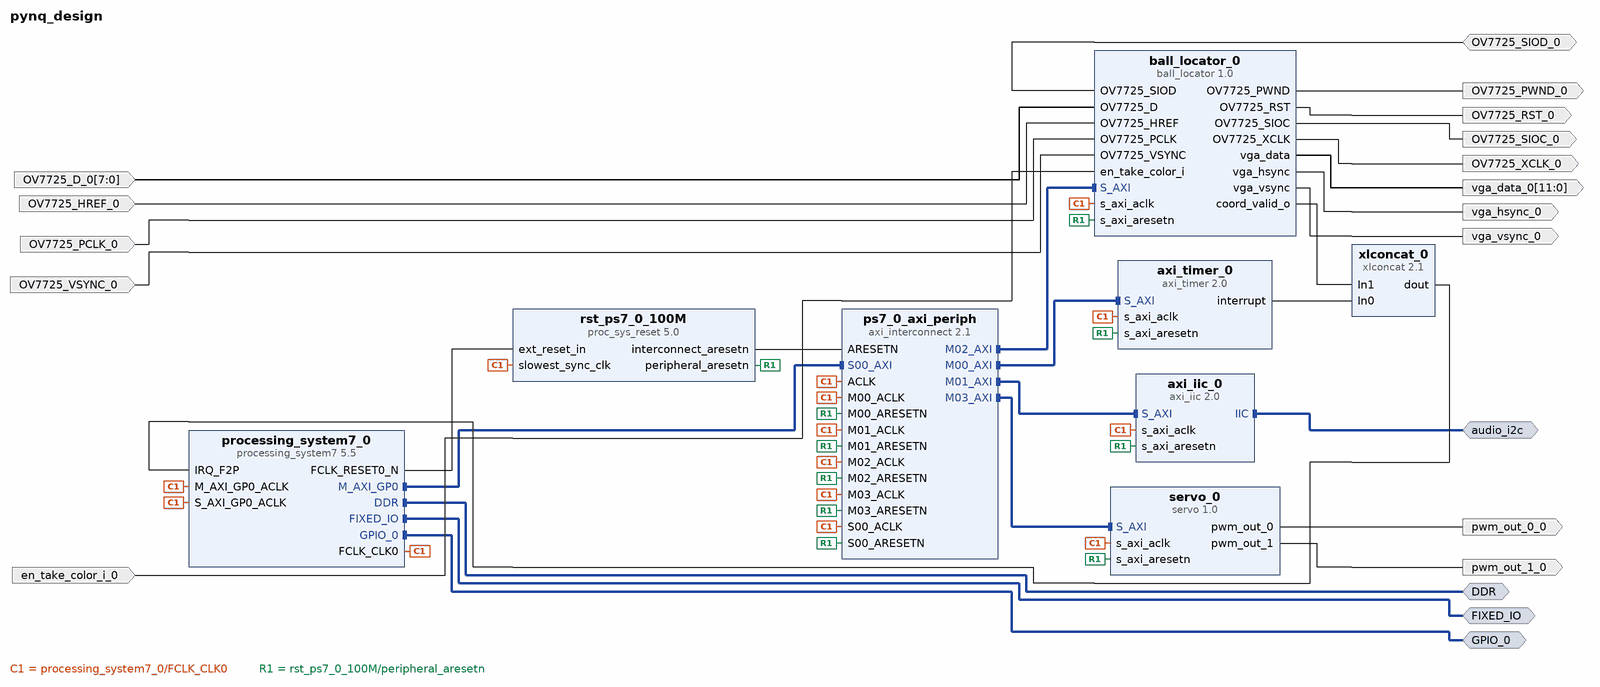
[diagram p0: block diagram of the top level]
# Vivado block design pynq_design, xc7z020clg400-1, Vivado 2018.2
create_bd_design pynq_design

create_bd_intf_port -mode Master -vlnv xilinx.com:interface:ddrx_rtl:1.0 DDR
create_bd_intf_port -mode Master -vlnv xilinx.com:display_processing_system7:fixedio_rtl:1.0 FIXED_IO
create_bd_intf_port -mode Master -vlnv xilinx.com:interface:gpio_rtl:1.0 GPIO_0
create_bd_intf_port -mode Master -vlnv xilinx.com:interface:iic_rtl:1.0 audio_i2c
create_bd_port -dir I -from 7 -to 0 OV7725_D_0
create_bd_port -dir I OV7725_HREF_0
create_bd_port -dir I OV7725_PCLK_0
create_bd_port -dir O OV7725_PWND_0
create_bd_port -dir O -type rst OV7725_RST_0
create_bd_port -dir O OV7725_SIOC_0
create_bd_port -dir IO OV7725_SIOD_0
create_bd_port -dir I OV7725_VSYNC_0
create_bd_port -dir O OV7725_XCLK_0
create_bd_port -dir I en_take_color_i_0
create_bd_port -dir O -from 11 -to 0 vga_data_0
create_bd_port -dir O vga_hsync_0
create_bd_port -dir O vga_vsync_0
create_bd_port -dir O pwm_out_0_0
create_bd_port -dir O pwm_out_1_0

create_bd_cell -type ip -vlnv xilinx.com:ip:processing_system7:5.5 processing_system7_0
set_property -dict [list \
  CONFIG.PCW_UIPARAM_DDR_FREQ_MHZ 525 \
  CONFIG.PCW_CRYSTAL_PERIPHERAL_FREQMHZ 50 \
  CONFIG.PCW_APU_PERIPHERAL_FREQMHZ 650 \
  CONFIG.PCW_UART_PERIPHERAL_FREQMHZ 100 \
  CONFIG.PCW_FPGA0_PERIPHERAL_FREQMHZ 100 \
  CONFIG.PCW_FPGA1_PERIPHERAL_FREQMHZ 142 \
  CONFIG.PCW_FPGA2_PERIPHERAL_FREQMHZ 200 \
  CONFIG.PCW_FPGA3_PERIPHERAL_FREQMHZ 160 \
  CONFIG.PCW_USE_S_AXI_GP0 1 \
  CONFIG.PCW_USE_FABRIC_INTERRUPT 1 \
  CONFIG.PCW_USE_HIGH_OCM 1 \
  CONFIG.PCW_GPIO_EMIO_GPIO_WIDTH 8 \
  CONFIG.PCW_IRQ_F2P_INTR 1 \
  CONFIG.PCW_GP0_EN_MODIFIABLE_TXN 0 \
  CONFIG.PCW_GP1_EN_MODIFIABLE_TXN 0 \
  CONFIG.PCW_PERIPHERAL_BOARD_PRESET part0 \
  CONFIG.PCW_PRESET_BANK1_VOLTAGE {LVCMOS 1.8V} \
  CONFIG.PCW_UIPARAM_DDR_BUS_WIDTH {16 Bit} \
  CONFIG.PCW_UIPARAM_DDR_PARTNO Custom \
  CONFIG.PCW_QSPI_PERIPHERAL_ENABLE 1 \
  CONFIG.PCW_QSPI_QSPI_IO {MIO 1 .. 6} \
  CONFIG.PCW_QSPI_GRP_SINGLE_SS_ENABLE 1 \
  CONFIG.PCW_QSPI_GRP_SINGLE_SS_IO {MIO 1 .. 6} \
  CONFIG.PCW_SINGLE_QSPI_DATA_MODE x4 \
  CONFIG.PCW_QSPI_GRP_FBCLK_ENABLE 1 \
  CONFIG.PCW_QSPI_GRP_FBCLK_IO {MIO 8} \
  CONFIG.PCW_ENET0_PERIPHERAL_ENABLE 1 \
  CONFIG.PCW_ENET0_ENET0_IO {MIO 16 .. 27} \
  CONFIG.PCW_ENET0_GRP_MDIO_ENABLE 1 \
  CONFIG.PCW_ENET0_GRP_MDIO_IO {MIO 52 .. 53} \
  CONFIG.PCW_ENET_RESET_ENABLE 0 \
  CONFIG.PCW_SD0_PERIPHERAL_ENABLE 0 \
  CONFIG.PCW_UART0_PERIPHERAL_ENABLE 1 \
  CONFIG.PCW_UART0_UART0_IO {MIO 14 .. 15} \
  CONFIG.PCW_UART1_PERIPHERAL_ENABLE 0 \
  CONFIG.PCW_WDT_PERIPHERAL_ENABLE 1 \
  CONFIG.PCW_WDT_WDT_IO EMIO \
  CONFIG.PCW_TTC0_PERIPHERAL_ENABLE 1 \
  CONFIG.PCW_TTC0_TTC0_IO EMIO \
  CONFIG.PCW_USB0_PERIPHERAL_ENABLE 0 \
  CONFIG.PCW_USB_RESET_ENABLE 0 \
  CONFIG.PCW_I2C_RESET_ENABLE 0 \
  CONFIG.PCW_GPIO_MIO_GPIO_ENABLE 1 \
  CONFIG.PCW_GPIO_MIO_GPIO_IO MIO \
  CONFIG.PCW_GPIO_EMIO_GPIO_ENABLE 1 \
  CONFIG.PCW_GPIO_EMIO_GPIO_IO 8 \
] [get_bd_cells processing_system7_0]
# 512 more settings of processing_system7_0 are not shown: defaults, MIO pin electricals, DDR timing, and values the tool derives
create_bd_cell -type ip -vlnv xilinx.com:ip:axi_timer:2.0 axi_timer_0
create_bd_cell -type ip -vlnv xilinx.com:ip:axi_interconnect:2.1 ps7_0_axi_periph
set_property -dict {CONFIG.NUM_MI 4} [get_bd_cells ps7_0_axi_periph]
create_bd_cell -type ip -vlnv xilinx.com:ip:proc_sys_reset:5.0 rst_ps7_0_100M
create_bd_cell -type ip -vlnv xilinx.com:ip:xlconcat:2.1 xlconcat_0
create_bd_cell -type ip -vlnv starrynightzyq.com:user:ball_locator:1.0 ball_locator_0
create_bd_cell -type ip -vlnv xilinx.com:ip:axi_iic:2.0 axi_iic_0
set_property -dict {CONFIG.USE_BOARD_FLOW true CONFIG.IIC_BOARD_INTERFACE audio_i2c} [get_bd_cells axi_iic_0]
create_bd_cell -type ip -vlnv starrynightzyq.com:user:servo:1.0 servo_0

# ---- connections ----

connect_bd_intf_net [get_bd_intf_pins processing_system7_0/M_AXI_GP0] [get_bd_intf_pins ps7_0_axi_periph/S00_AXI]
connect_bd_intf_net [get_bd_intf_pins ps7_0_axi_periph/M00_AXI] [get_bd_intf_pins axi_timer_0/S_AXI]
connect_bd_intf_net [get_bd_intf_pins ps7_0_axi_periph/M02_AXI] [get_bd_intf_pins ball_locator_0/S_AXI]
connect_bd_intf_net [get_bd_intf_pins ps7_0_axi_periph/M01_AXI] [get_bd_intf_pins axi_iic_0/S_AXI]
connect_bd_intf_net [get_bd_intf_pins ps7_0_axi_periph/M03_AXI] [get_bd_intf_pins servo_0/S_AXI]
connect_bd_intf_net [get_bd_intf_ports DDR] [get_bd_intf_pins processing_system7_0/DDR]
connect_bd_intf_net [get_bd_intf_ports FIXED_IO] [get_bd_intf_pins processing_system7_0/FIXED_IO]
connect_bd_intf_net [get_bd_intf_ports GPIO_0] [get_bd_intf_pins processing_system7_0/GPIO_0]
connect_bd_intf_net [get_bd_intf_ports audio_i2c] [get_bd_intf_pins axi_iic_0/IIC]
connect_bd_net [get_bd_pins processing_system7_0/FCLK_CLK0] \
  [get_bd_pins processing_system7_0/M_AXI_GP0_ACLK] [get_bd_pins processing_system7_0/S_AXI_GP0_ACLK] \
  [get_bd_pins rst_ps7_0_100M/slowest_sync_clk] [get_bd_pins axi_timer_0/s_axi_aclk] [get_bd_pins ps7_0_axi_periph/S00_ACLK] \
  [get_bd_pins ps7_0_axi_periph/M00_ACLK] [get_bd_pins ps7_0_axi_periph/ACLK] [get_bd_pins ps7_0_axi_periph/M01_ACLK] \
  [get_bd_pins ball_locator_0/s_axi_aclk] [get_bd_pins ps7_0_axi_periph/M02_ACLK] [get_bd_pins axi_iic_0/s_axi_aclk] \
  [get_bd_pins servo_0/s_axi_aclk] [get_bd_pins ps7_0_axi_periph/M03_ACLK]
connect_bd_net [get_bd_pins processing_system7_0/FCLK_RESET0_N] [get_bd_pins rst_ps7_0_100M/ext_reset_in]
connect_bd_net [get_bd_pins rst_ps7_0_100M/peripheral_aresetn] \
  [get_bd_pins axi_timer_0/s_axi_aresetn] [get_bd_pins ps7_0_axi_periph/S00_ARESETN] \
  [get_bd_pins ps7_0_axi_periph/M00_ARESETN] [get_bd_pins ps7_0_axi_periph/M01_ARESETN] \
  [get_bd_pins ball_locator_0/s_axi_aresetn] [get_bd_pins ps7_0_axi_periph/M02_ARESETN] [get_bd_pins axi_iic_0/s_axi_aresetn] \
  [get_bd_pins servo_0/s_axi_aresetn] [get_bd_pins ps7_0_axi_periph/M03_ARESETN]
connect_bd_net [get_bd_pins rst_ps7_0_100M/interconnect_aresetn] [get_bd_pins ps7_0_axi_periph/ARESETN]
connect_bd_net [get_bd_pins xlconcat_0/dout] [get_bd_pins processing_system7_0/IRQ_F2P]
connect_bd_net [get_bd_pins axi_timer_0/interrupt] [get_bd_pins xlconcat_0/In0]
connect_bd_net -net OV7725_D_0_1 [get_bd_ports OV7725_D_0] [get_bd_pins ball_locator_0/OV7725_D]
connect_bd_net -net OV7725_HREF_0_1 [get_bd_ports OV7725_HREF_0] [get_bd_pins ball_locator_0/OV7725_HREF]
connect_bd_net -net OV7725_PCLK_0_1 [get_bd_ports OV7725_PCLK_0] [get_bd_pins ball_locator_0/OV7725_PCLK]
connect_bd_net [get_bd_pins ball_locator_0/OV7725_PWND] [get_bd_ports OV7725_PWND_0]
connect_bd_net [get_bd_pins ball_locator_0/OV7725_RST] [get_bd_ports OV7725_RST_0]
connect_bd_net [get_bd_pins ball_locator_0/OV7725_SIOC] [get_bd_ports OV7725_SIOC_0]
connect_bd_net [get_bd_ports OV7725_SIOD_0] [get_bd_pins ball_locator_0/OV7725_SIOD]
connect_bd_net -net OV7725_VSYNC_0_1 [get_bd_ports OV7725_VSYNC_0] [get_bd_pins ball_locator_0/OV7725_VSYNC]
connect_bd_net [get_bd_pins ball_locator_0/OV7725_XCLK] [get_bd_ports OV7725_XCLK_0]
connect_bd_net -net en_take_color_i_0_1 [get_bd_ports en_take_color_i_0] [get_bd_pins ball_locator_0/en_take_color_i]
connect_bd_net [get_bd_pins ball_locator_0/vga_data] [get_bd_ports vga_data_0]
connect_bd_net [get_bd_pins ball_locator_0/vga_hsync] [get_bd_ports vga_hsync_0]
connect_bd_net [get_bd_pins ball_locator_0/vga_vsync] [get_bd_ports vga_vsync_0]
connect_bd_net [get_bd_pins ball_locator_0/coord_valid_o] [get_bd_pins xlconcat_0/In1]
connect_bd_net [get_bd_pins servo_0/pwm_out_0] [get_bd_ports pwm_out_0_0]
connect_bd_net [get_bd_pins servo_0/pwm_out_1] [get_bd_ports pwm_out_1_0]

# ---- address map ----
assign_bd_address -offset 0x41600000 -range 64K -target_address_space [get_bd_addr_spaces processing_system7_0/Data] [get_bd_addr_segs axi_iic_0/S_AXI/Reg]
assign_bd_address -offset 0x42800000 -range 64K -target_address_space [get_bd_addr_spaces processing_system7_0/Data] [get_bd_addr_segs axi_timer_0/S_AXI/Reg]
assign_bd_address -offset 0x43C00000 -range 64K -target_address_space [get_bd_addr_spaces processing_system7_0/Data] [get_bd_addr_segs ball_locator_0/S_AXI/S_AXI_reg]
assign_bd_address -offset 0x43C10000 -range 64K -target_address_space [get_bd_addr_spaces processing_system7_0/Data] [get_bd_addr_segs servo_0/S_AXI/S_AXI_reg]

validate_bd_design
save_bd_design
